# Altium schematic sheet Microcontroller_ESP32_S3.SchDoc
size A; SheetNumber: 2; SheetTotal: 7
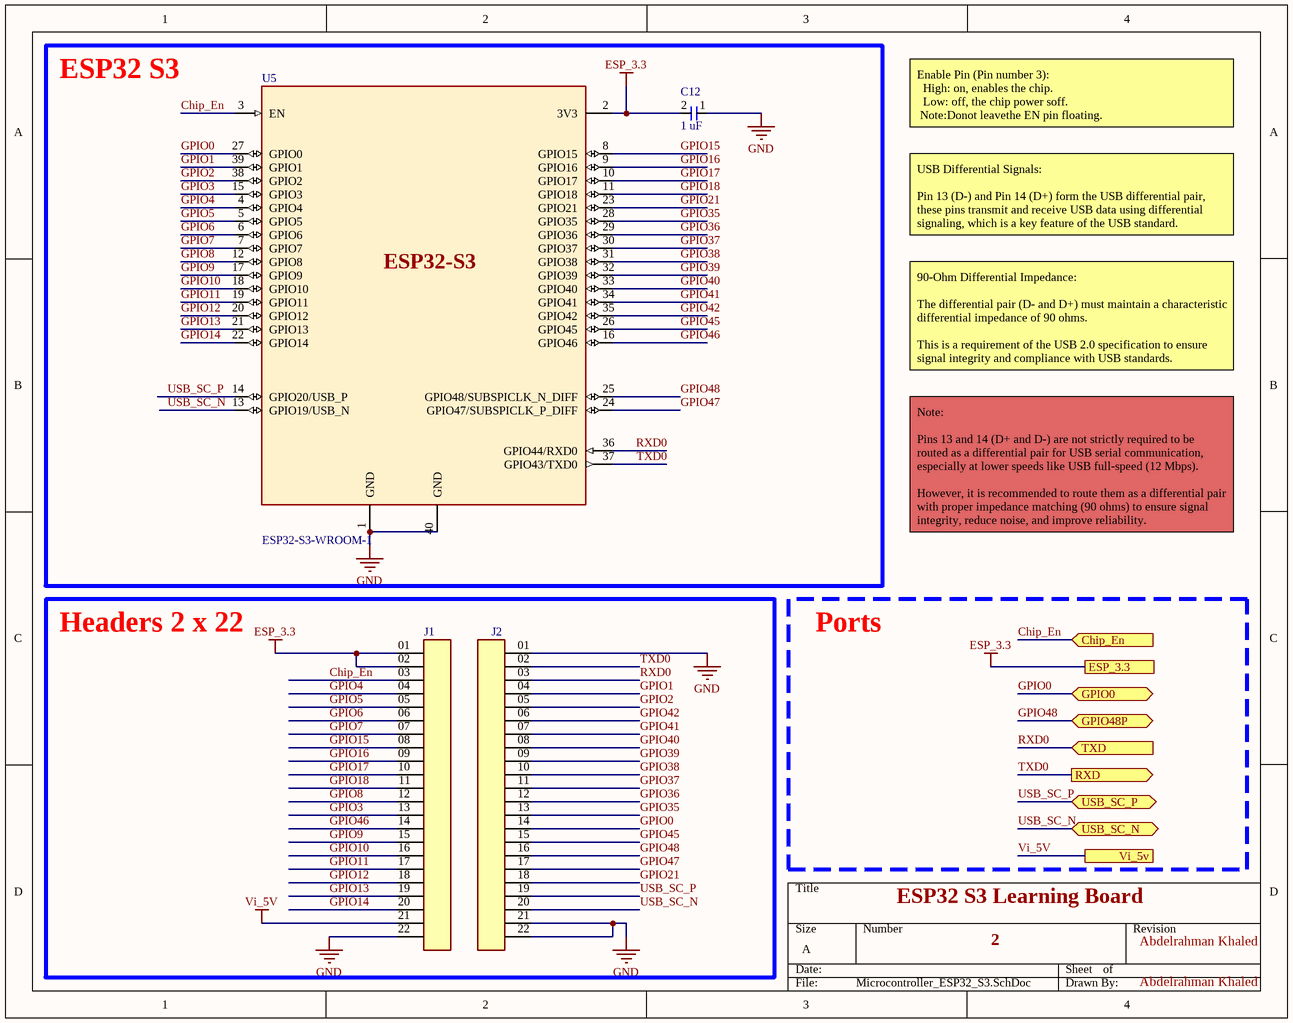
[diagram p0: Microcontroller_ESP32_S3.SchDoc]

## Parts
C12  1 uF  [Capacitor]
J1  Header 1x22  [Header 1xx22]  (value not drawn)
J2  Header 1x22  [Header 1xx22]  (value not drawn)
U5  ESP32-S3-WROOM-1  [ESP32-S3-WROOM-1-N4]

## Blocks framed on the sheet
ESP32 S3: C12 U5
Headers 2 x 22: J1 J2

## Ports
Chip_En (in, see Block Diagram[2B], Microcontroller's_Prephirals_Sheet[4A]), ESP_3.3 (see Block Diagram[2B], Microcontroller's_Prephirals_Sheet[4A]), GPIO0 (bidir, see Block Diagram[2B], Microcontroller's_Prephirals_Sheet[4A]), GPIO48P (bidir, see Block Diagram[2B], RGB_Logical_Shifter_Sheet[4A]), RXD (out, see Block Diagram[2B], USB_UART_Converter[3B]), TXD (in, see Block Diagram[2B], USB_UART_Converter[3B]), USB_SC_N (bidir, see Block Diagram[2B], USB_Communication_Sheet[4C]), USB_SC_P (bidir, see Block Diagram[2B], USB_Communication_Sheet[4B]), Vi_5v (see Block Diagram[2B], LDO_Sheet[4B], RGB_Logical_Shifter_Sheet[4A], USB_Communication_Sheet[4B], USB_UART_Converter[4A])

## Nets
ESP_3.3: C12.2(Pin_2) J1.01 J1.02 U5.2(3V3) ; port ESP_3.3
GND: C12.1(Pin_1) J1.22 J2.01 J2.21 J2.22 U5.1(GND) U5.40(GND)
Vi_5V: J1.21 ; port Vi_5v
Chip_En: J1.03 U5.3(EN) ; port Chip_En
GPIO0: J2.14 U5.27(GPIO0) ; port GPIO0
GPIO1: J2.04 U5.39(GPIO1)
GPIO2: J2.05 U5.38(GPIO2)
GPIO3: J1.13 U5.15(GPIO3)
GPIO4: J1.04 U5.4(GPIO4)
GPIO5: J1.05 U5.5(GPIO5)
GPIO6: J1.06 U5.6(GPIO6)
GPIO7: J1.07 U5.7(GPIO7)
GPIO8: J1.12 U5.12(GPIO8)
GPIO9: J1.15 U5.17(GPIO9)
GPIO10: J1.16 U5.18(GPIO10)
GPIO11: J1.17 U5.19(GPIO11)
GPIO12: J1.18 U5.20(GPIO12)
GPIO13: J1.19 U5.21(GPIO13)
GPIO14: J1.20 U5.22(GPIO14)
GPIO15: J1.08 U5.8(GPIO15)
GPIO16: J1.09 U5.9(GPIO16)
GPIO17: J1.10 U5.10(GPIO17)
GPIO18: J1.11 U5.11(GPIO18)
GPIO21: J2.18 U5.23(GPIO21)
GPIO35: J2.13 U5.28(GPIO35)
GPIO36: J2.12 U5.29(GPIO36)
GPIO37: J2.11 U5.30(GPIO37)
GPIO38: J2.10 U5.31(GPIO38)
GPIO39: J2.09 U5.32(GPIO39)
GPIO40: J2.08 U5.33(GPIO40)
GPIO41: J2.07 U5.34(GPIO41)
GPIO42: J2.06 U5.35(GPIO42)
GPIO45: J2.15 U5.26(GPIO45)
GPIO46: J1.14 U5.16(GPIO46)
GPIO47: J2.17 U5.24(GPIO47/SUBSPICLK_P_DIFF)
GPIO48: J2.16 U5.25(GPIO48/SUBSPICLK_N_DIFF) ; port GPIO48P
RXD0: J2.03 U5.36(GPIO44/RXD0) ; port TXD
TXD0: J2.02 U5.37(GPIO43/TXD0) ; port RXD
USB_SC_N: J2.20 U5.13(GPIO19/USB_N) ; port USB_SC_N
USB_SC_P: J2.19 U5.14(GPIO20/USB_P) ; port USB_SC_P

## Notes on the sheet
- Enable Pin (Pin number 3):
  High: on, enables the chip.
  Low: off, the chip power soff.
  Note:Donot leavethe EN pin floating.
- USB Differential Signals:
  Pin 13 (D-) and Pin 14 (D+) form the USB differential pair, these pins transmit and receive USB data using differential signaling, which is a key feature of the USB standard.
- 90-Ohm Differential Impedance:
  The differential pair (D- and D+) must maintain a characteristic differential impedance of 90 ohms.
  This is a requirement of the USB 2.0 specification to ensure signal integrity and compliance with USB standards.
- Note:
  Pins 13 and 14 (D+ and D-) are not strictly required to be routed as a differential pair for USB serial communication, especially at lower speeds like USB full-speed (12 Mbps).
  However, it is recommended to route them as a differential pair with proper impedance matching (90 ohms) to ensure signal integrity, reduce noise, and improve reliability.
- Ports
- ESP32 S3 Learning Board
- 2
- Abdelrahman Khaled
- (in symbol ESP32-S3-WROOM-1) ESP32-S3

## Library data of the parts
C12 = Capacitor
U5 = ESP32-S3-WROOM-1: 2.4 GHz Wi-Fi (802.11b/g/n) and Bluetooth® 5 module / Built around ESP32-S3 series of SoCs, Xtensa® dual-core 32-bit LX7 microprocessor / Flash up to 16 MB, PSRAM up to 16 MB / Up to 36 GPIOs, rich set of peripherals / On-board PCB antenna or external antenna connector; ComponentLink1Description: Links; ComponentLink1URL: https://docs.espressif.com/projects/esp-dev-kits/en/latest/esp32s3/esp32-s3-devkitc-1/user_guide_v1.0.html#hardware-reference